# EAGLE design vca (EAGLE 7.5.0)
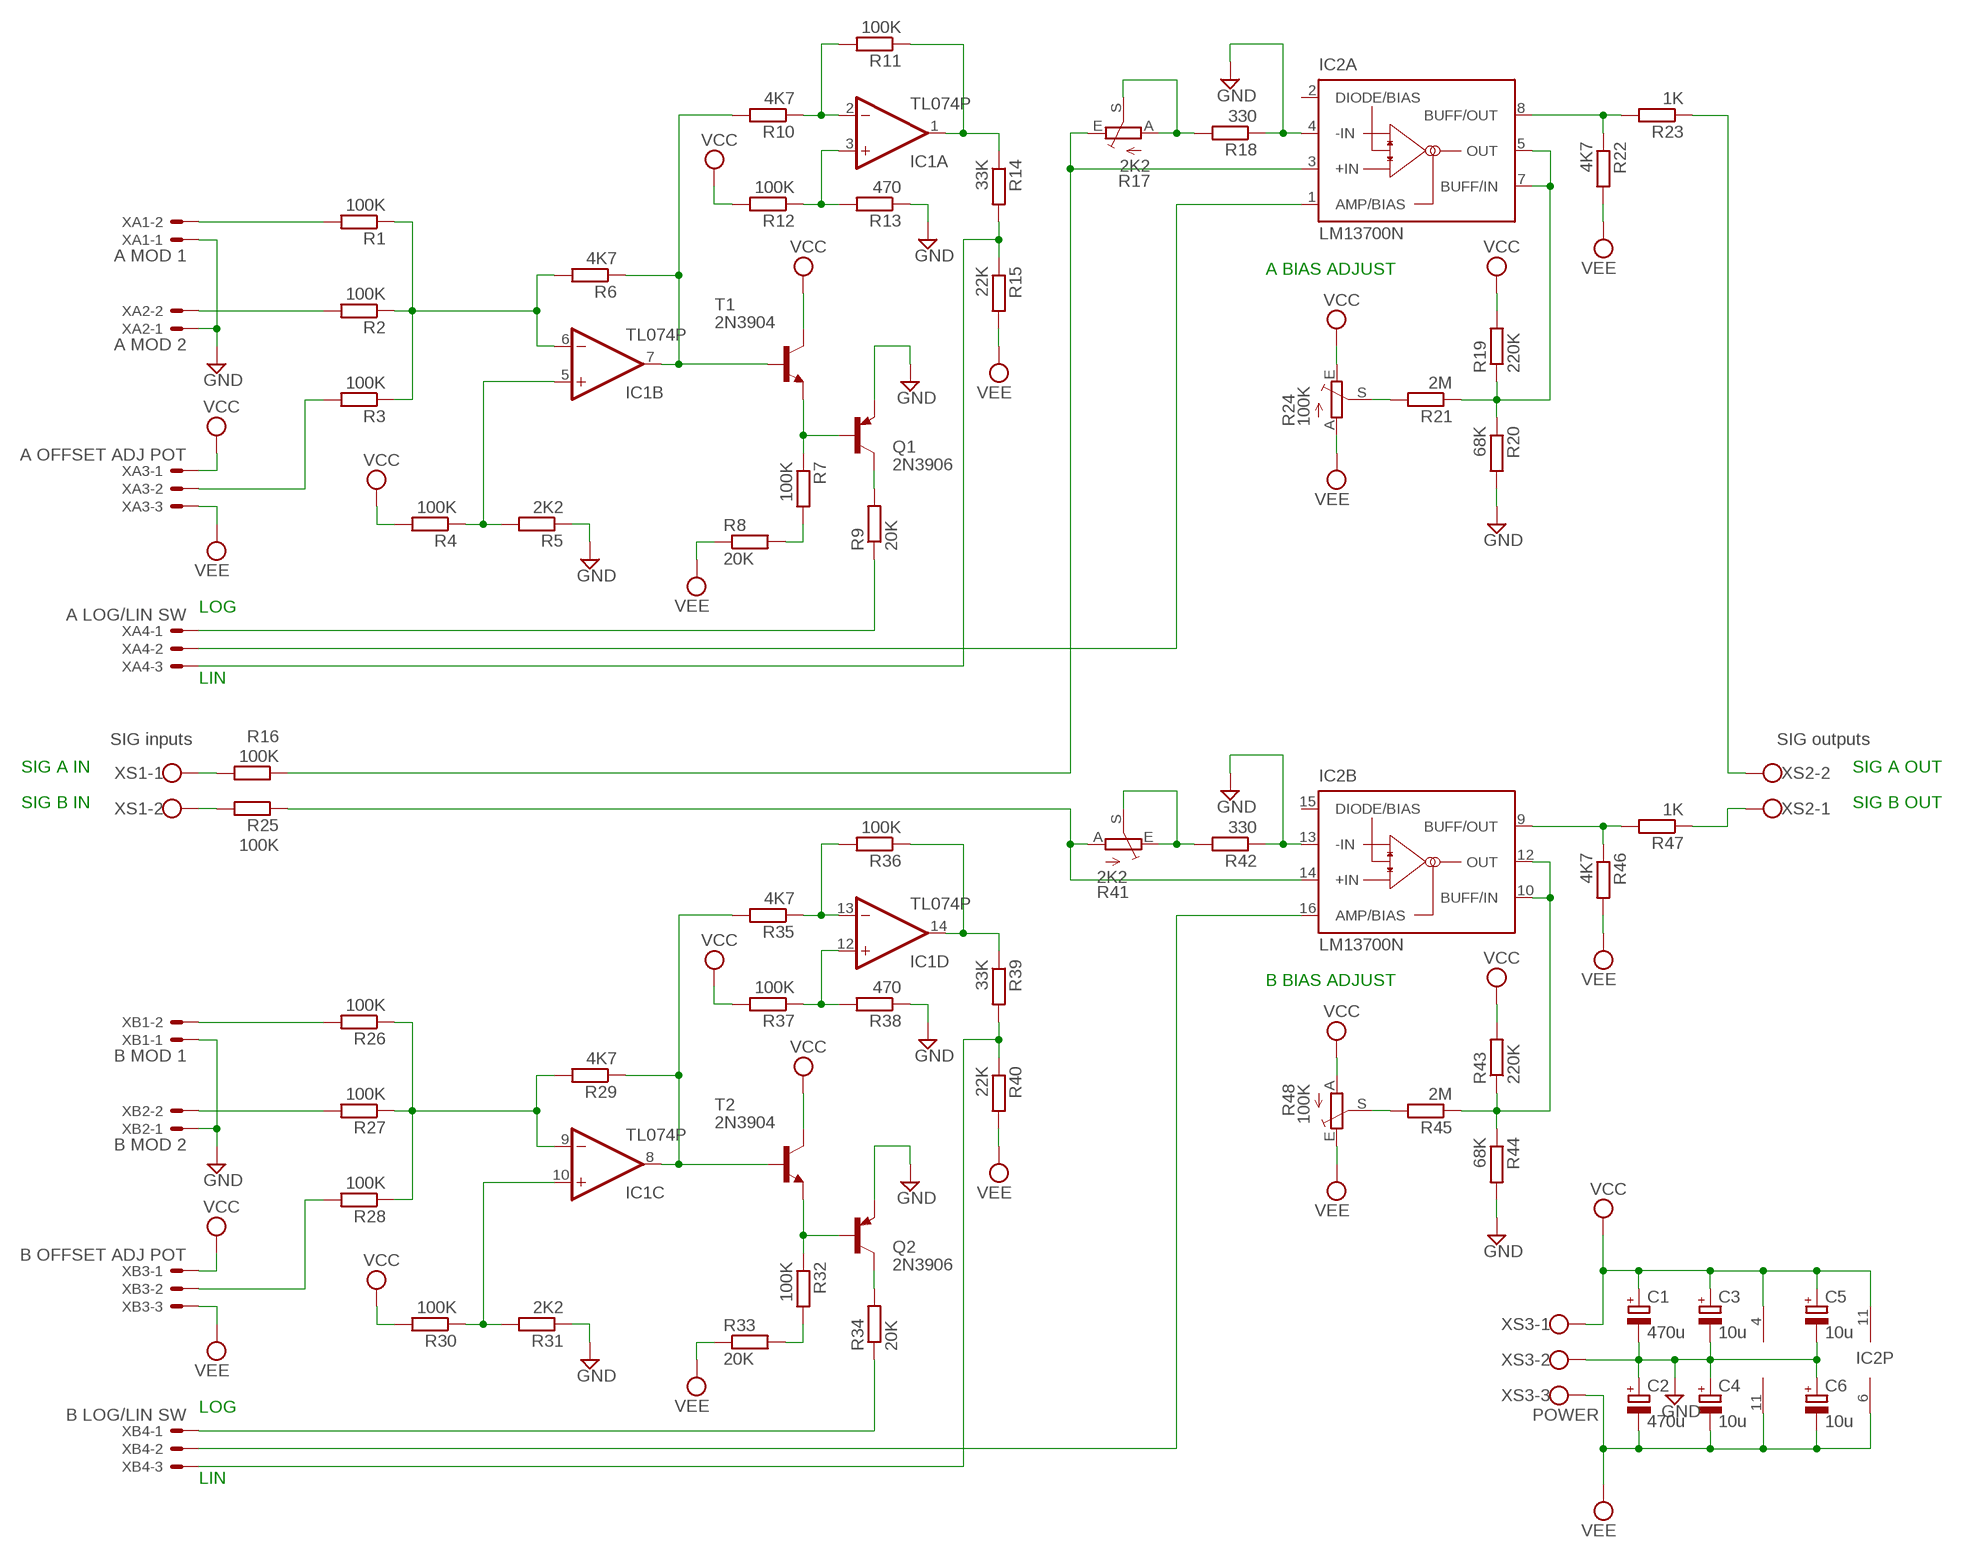
[diagram p0: schematic, sheet 1]

## Parts
C1  470u  CPOL-EUE2.5-6  [E2,5-6]
C2  470u  CPOL-EUE2.5-6  [E2,5-6]
C3  10u  CPOL-EUE1.8-4  [E1,8-4]
C4  10u  CPOL-EUE1.8-4  [E1,8-4]
C5  10u  CPOL-EUE1.8-4  [E1,8-4]
C6  10u  CPOL-EUE1.8-4  [E1,8-4]
IC1  TL074P  [DIL14]
IC2  LM13700N  LM13600AN  [DIL16]
Q1  2N3906  [TO92]
Q2  2N3906  [TO92]
R1  100K  R-EU_0204/7  [0204/7]
R2  100K  R-EU_0204/7  [0204/7]
R3  100K  R-EU_0204/7  [0204/7]
R4  100K  R-EU_0204/7  [0204/7]
R5  2K2  R-EU_0204/7  [0204/7]
R6  4K7  R-EU_0204/7  [0204/7]
R7  100K  R-EU_0204/7  [0204/7]
R8  20K  R-EU_0204/7  [0204/7]
R9  20K  R-EU_0204/7  [0204/7]
R10  4K7  R-EU_0204/7  [0204/7]
R11  100K  R-EU_0204/7  [0204/7]
R12  100K  R-EU_0204/7  [0204/7]
R13  470  R-EU_0204/7  [0204/7]
R14  33K  R-EU_0204/7  [0204/7]
R15  22K  R-EU_0204/7  [0204/7]
R16  100K  R-EU_0204/7  [0204/7]
R17  2K2  TRIM_EU-CA6V  [CA6V]
R18  330  R-EU_0204/7  [0204/7]
R19  220K  R-EU_0204/7  [0204/7]
R20  68K  R-EU_0204/7  [0204/7]
R21  2M  R-EU_0204/7  [0204/7]
R22  4K7  R-EU_0204/7  [0204/7]
R23  1K  R-EU_0204/7  [0204/7]
R24  100K  TRIM_EU-CA6V  [CA6V]
R25  100K  R-EU_0204/7  [0204/7]
R26  100K  R-EU_0204/7  [0204/7]
R27  100K  R-EU_0204/7  [0204/7]
R28  100K  R-EU_0204/7  [0204/7]
R29  4K7  R-EU_0204/7  [0204/7]
R30  100K  R-EU_0204/7  [0204/7]
R31  2K2  R-EU_0204/7  [0204/7]
R32  100K  R-EU_0204/7  [0204/7]
R33  20K  R-EU_0204/7  [0204/7]
R34  20K  R-EU_0204/7  [0204/7]
R35  4K7  R-EU_0204/7  [0204/7]
R36  100K  R-EU_0204/7  [0204/7]
R37  100K  R-EU_0204/7  [0204/7]
R38  470  R-EU_0204/7  [0204/7]
R39  33K  R-EU_0204/7  [0204/7]
R40  22K  R-EU_0204/7  [0204/7]
R41  2K2  TRIM_EU-CA6V  [CA6V]
R42  330  R-EU_0204/7  [0204/7]
R43  220K  R-EU_0204/7  [0204/7]
R44  68K  R-EU_0204/7  [0204/7]
R45  2M  R-EU_0204/7  [0204/7]
R46  4K7  R-EU_0204/7  [0204/7]
R47  1K  R-EU_0204/7  [0204/7]
R48  100K  TRIM_EU-CA6V  [CA6V]
T1  2N3904  [TO92]
T2  2N3904  [TO92]
XA1  A MOD 1  22-23-2021  [22-23-2021]
XA2  A MOD 2  22-23-2021  [22-23-2021]
XA3  A OFFSET ADJ POT  22-23-2031  [22-23-2031]
XA4  A LOG/LIN SW  22-23-2031  [22-23-2031]
XB1  B MOD 1  22-23-2021  [22-23-2021]
XB2  B MOD 2  22-23-2021  [22-23-2021]
XB3  B OFFSET ADJ POT  22-23-2031  [22-23-2031]
XB4  B LOG/LIN SW  22-23-2031  [22-23-2031]
XS1  SIG inputs  W237-102  [W237-102]
XS2  SIG outputs  W237-102  [W237-102]
XS3  POWER  W237-103  [W237-103]

## Nets
GND: C1.- C2.+ C3.- C4.+ C5.- C6.+ IC2.4(A:-IN) IC2.13(B:-IN) Q1.3(E) Q2.3(E) R5.1 R13.1 R18.1 R20.2 R31.1 R38.1 R42.1 R44.2 XA1.1 XA2.1 XB1.1 XB2.1 XS3.2
N$1: IC1.6(B:-IN) R1.1 R2.1 R3.1 R6.2
N$2: R1.2 XA1.2
N$3: R2.2 XA2.2
N$4: R3.2 XA3.2
N$5: IC1.5(B:+IN) R4.1 R5.2
N$6: R7.2 R8.2
N$7: IC1.7(B:OUT) R6.1 R10.2 T1.2(B)
N$8: Q1.2(B) R7.1 T1.3(E)
N$9: Q1.1(C) R9.2
N$10: R9.1 XA4.1
N$11: IC1.2(A:-IN) R10.1 R11.2
N$12: IC2.1(A:AMP/BIAS) XA4.2
N$13: IC1.1(A:OUT) R11.1 R14.1
N$14: IC2.3(A:+IN) R16.1 R17.E
N$15: IC1.3(A:+IN) R12.1 R13.2
N$16: R17.A R17.S R18.2
N$17: R14.2 R15.1 XA4.3
N$18: IC2.8(A:BUFF/OUT) R22.1 R23.2
N$20: R16.2 XS1.1
N$21: R25.2 XS1.2
N$23: R21.2 R24.S
N$24: IC2.5(A:OUT) IC2.7(A:BUFF/IN) R19.1 R20.1 R21.1
N$25: IC2.14(B:+IN) R25.1 R41.A
N$26: R26.2 XB1.2
N$27: R23.1 XS2.2
N$28: R27.2 XB2.2
N$29: R28.2 XB3.2
N$30: R34.1 XB4.1
N$31: R47.1 XS2.1
N$32: IC2.16(B:AMP/BIAS) XB4.2
N$35: IC1.9(C:-IN) R26.1 R27.1 R28.1 R29.2
N$36: IC1.8(C:OUT) R29.1 R35.2 T2.2(B)
N$37: IC1.10(C:+IN) R30.1 R31.2
N$39: Q2.2(B) R32.1 T2.3(E)
N$40: R32.2 R33.2
N$41: Q2.1(C) R34.2
N$42: IC1.13(D:-IN) R35.1 R36.2
N$43: IC1.14(D:OUT) R36.1 R39.1
N$44: IC1.12(D:+IN) R37.1 R38.2
N$45: R39.2 R40.1 XB4.3
N$46: R41.E R41.S R42.2
N$47: R45.2 R48.S
N$49: IC2.9(B:BUFF/OUT) R46.1 R47.2
N$50: IC2.10(B:BUFF/IN) IC2.12(B:OUT) R43.1 R44.1 R45.1
VCC: C1.+ C3.+ C5.+ IC1.4(P:V+) IC2.11(P:V+) R4.2 R12.2 R19.2 R24.E R30.2 R37.2 R43.2 R48.A T1.1(C) T2.1(C) XA3.1 XB3.1 XS3.1
VEE: C2.- C4.- C6.- IC1.11(P:V-) IC2.6(P:V-) R8.1 R15.2 R22.2 R24.A R33.1 R40.2 R46.2 R48.E XA3.3 XB3.3 XS3.3
Unconnected: IC2.2(A:DIODE/BIAS) IC2.15(B:DIODE/BIAS)

## Notes on the sheet
- A BIAS ADJUST
- LOG
- LIN
- SIG A IN | SIG A OUT
- SIG B IN | SIG B OUT
- B BIAS ADJUST
- LOG
- LIN

## Library data of the parts
C1-C6 = rcl:CPOL-EU: POLARIZED CAPACITOR, European symbol
IC1 = linear:TL074: OP AMP
IC2 = national-semiconductor:LM13600: Dual Operational Transconductance Amplifiers with Linearizing Diodes and Buffers Source: lm13600.PDF
Q1 Q2 = transistor-pnp:2N3906: PNP Transistor
R1-R16 R18-R23 R25-R40 R42-R47 = rcl:R-EU_: RESISTOR, European symbol
R17 R24 R41 R48 = pot:TRIM_EU-: POTENTIOMETER
T1 T2 = transistor:2N3904: NPN TRANSISTOR
XA1 XA2 XB1 XB2 = con-molex:22-23-2021: .100" (2.54mm) Center Header - 2 Pin; MF: MOLEX; MPN: 22-23-2021; OC_FARNELL: 1462926; OC_NEWARK: 25C3832
XA3 XA4 XB3 XB4 = con-molex:22-23-2031: .100" (2.54mm) Center Header - 3 Pin; MF: MOLEX; MPN: 22-23-2031; OC_FARNELL: 1462950; OC_NEWARK: 30C0862
XS1 XS2 = con-wago-500:W237-102: WAGO SCREW CLAMP; MPN: 237-102; OC_FARNELL: unknown; OC_NEWARK: 70K9898
XS3 = con-wago-500:W237-103: WAGO SCREW CLAMP; MPN: 237-103; OC_FARNELL: unknown; OC_NEWARK: 18M7116

## Board
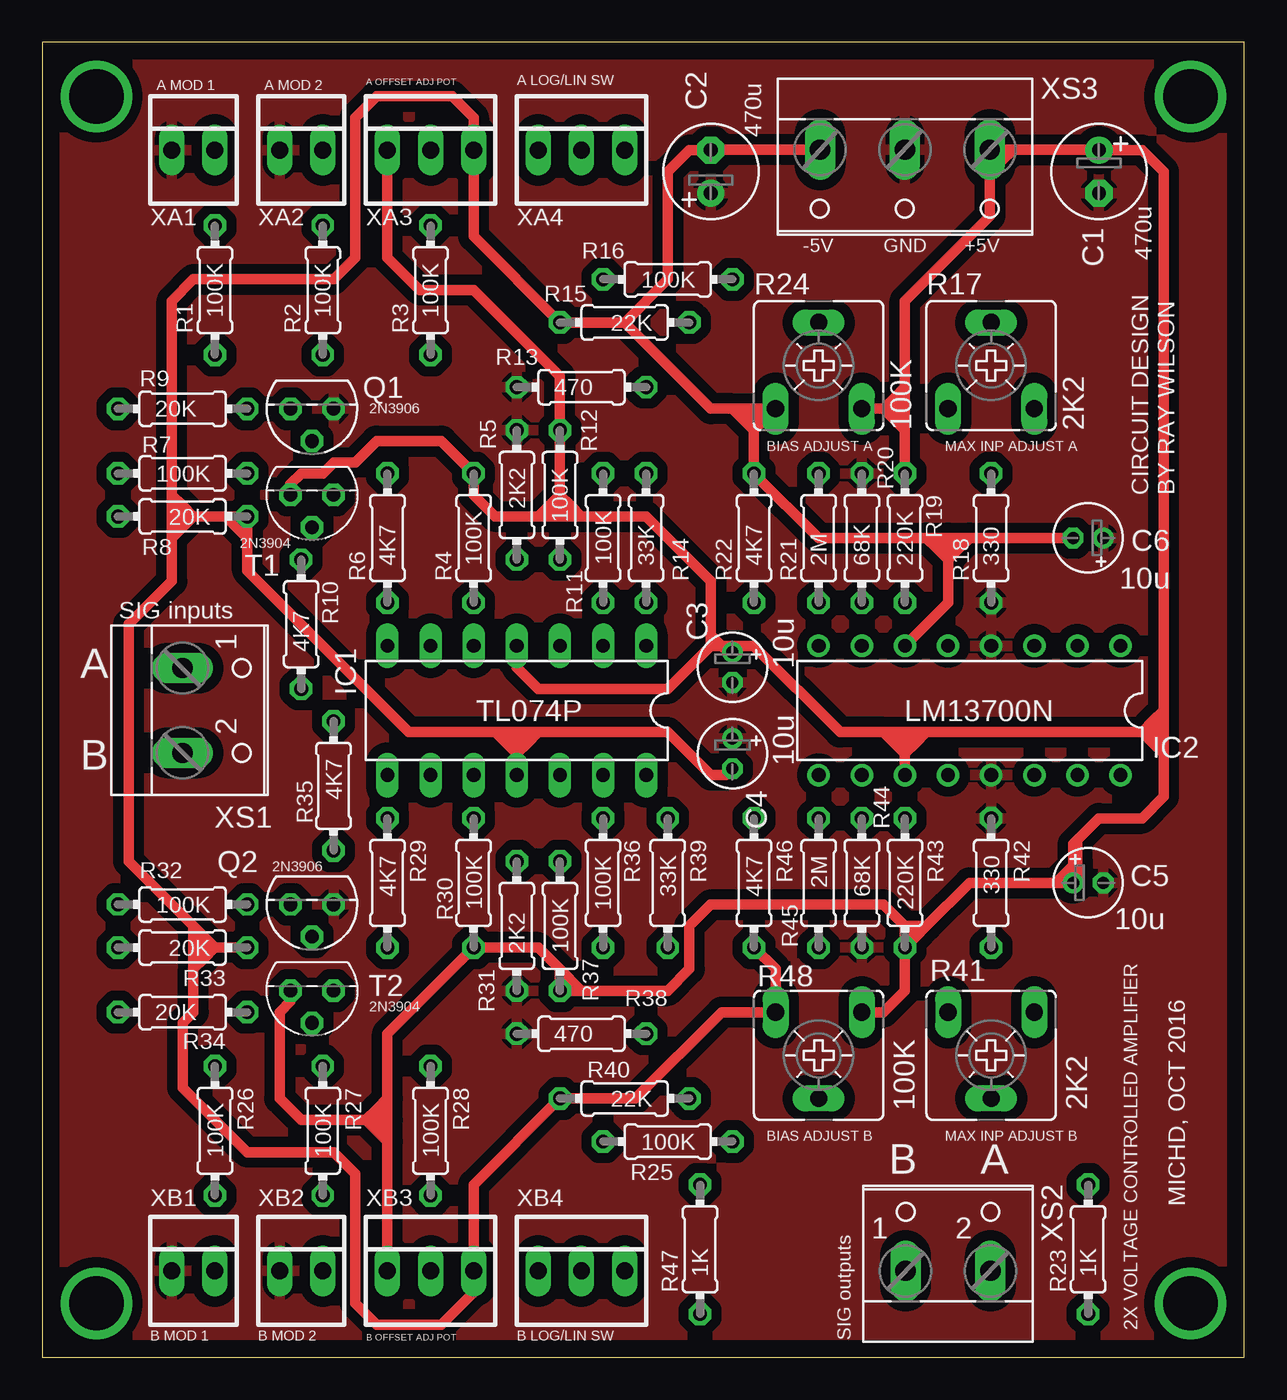
[diagram p1: board, top side]
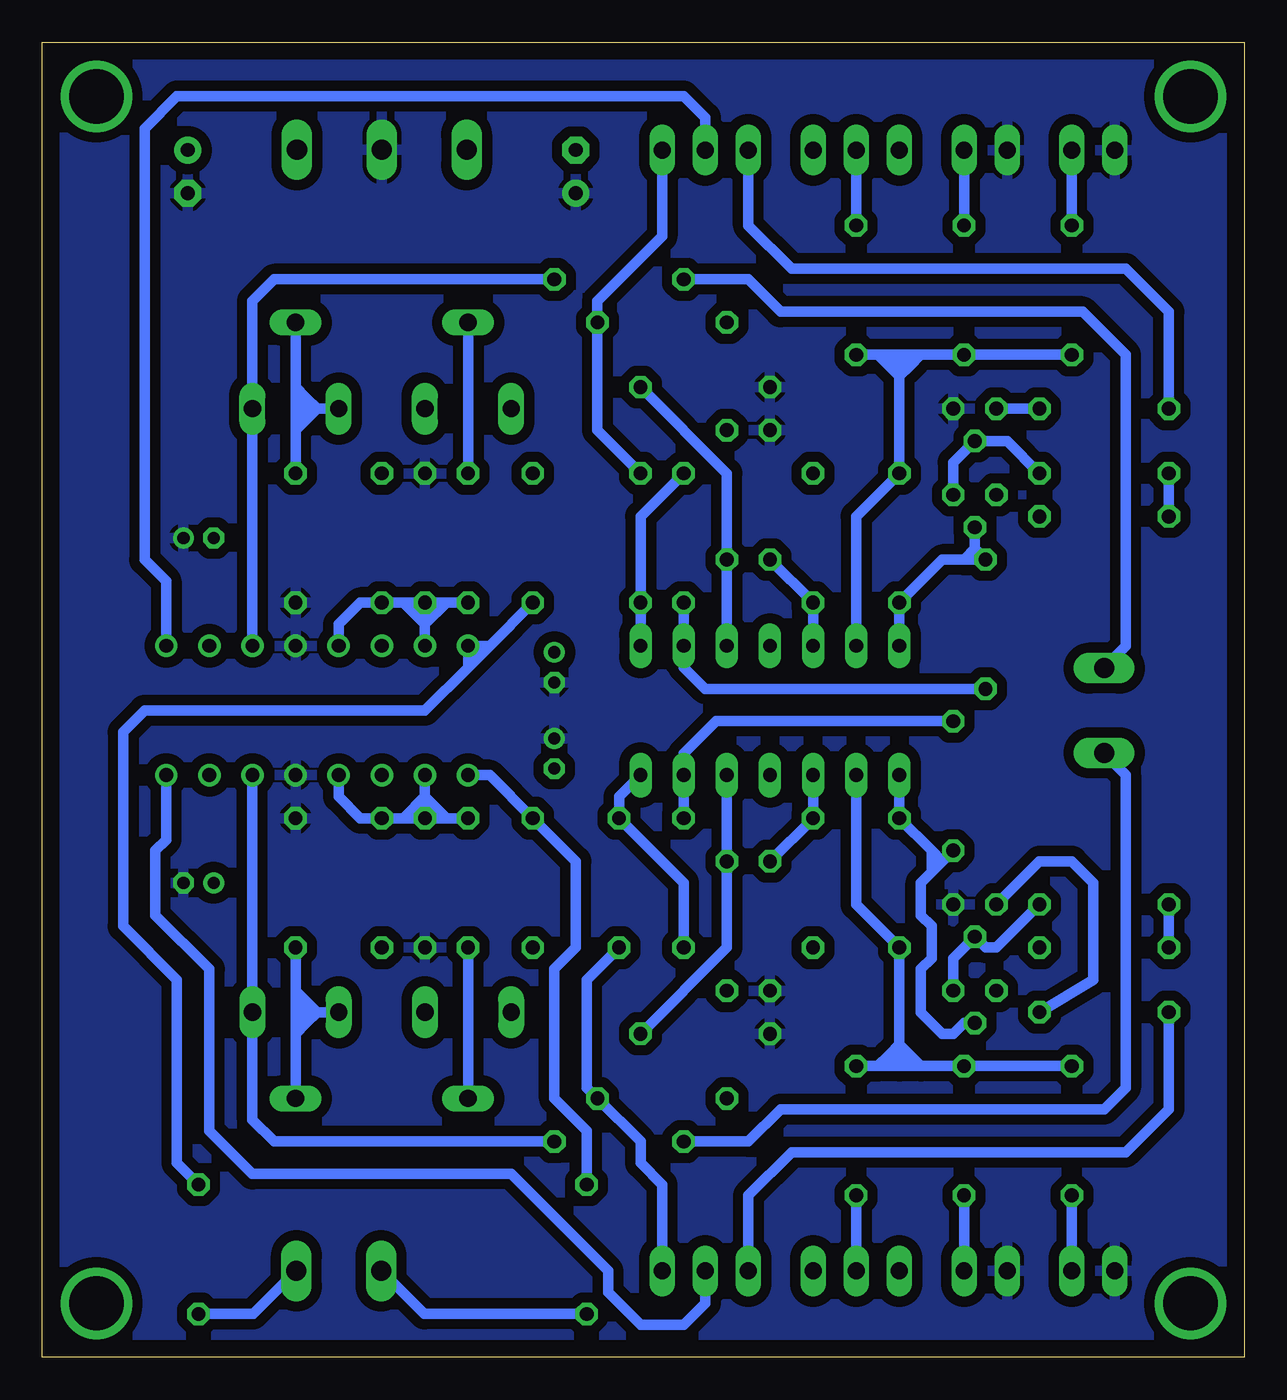
[diagram p2: board, bottom side, seen from below]

Size 70.79 x 77.46 mm. Coordinates in mm from the lower left corner, seen from the top.
Outline: 0,0 70.79,0 70.79,77.46 0,77.46 0,0
Copper layers (1*16): Top 0.035mm / dielectric 1.5mm / Bottom 0.035mm
Design rules "default": minimum track width 10mil, minimum drill 24mil, track to track 8mil, track to pad 8mil, pad to pad 8mil, via to via 8mil, smd to smd 8mil, copper to edge 40mil, drill to drill 8mil, minimum pad ring 10mil, minimum via ring 8mil, stop-mask expansion 4mil, vias tented up to drill 0mil, thermal gap 10mil

### Footprints (pad centres in the part's own frame; a part is rotated, then mirrored left to right if it is on the bottom)
E2,5-6 = drill 0.813 pad 1.6: + -1.27,0 | drill 0.813 pad 1.6 octagon: - 1.27,0
E1,8-4 = drill 0.711 pad 1.168: + -0.889,0 | drill 0.711 pad 1.168 octagon: - 0.889,0
DIL14 = drill 0.813 long: 1 -7.62,-3.81; 2 -5.08,-3.81; 3 -2.54,-3.81; 4 0,-3.81; 5 2.54,-3.81; 6 5.08,-3.81; 7 7.62,-3.81; 8 7.62,3.81; 9 5.08,3.81; 10 2.54,3.81; 11 0,3.81; 12 -2.54,3.81; 13 -5.08,3.81; 14 -7.62,3.81
DIL16 = drill 0.813 pad 1.27: 1 -8.89,-3.81; 2 -6.35,-3.81; 3 -3.81,-3.81; 4 -1.27,-3.81; 5 1.27,-3.81; 6 3.81,-3.81; 7 6.35,-3.81; 8 8.89,-3.81; 9 8.89,3.81; 10 6.35,3.81; 11 3.81,3.81; 12 1.27,3.81; 13 -1.27,3.81; 14 -3.81,3.81; 15 -6.35,3.81; 16 -8.89,3.81
TO92 = drill 0.813 octagon: 1 1.27,0; 2 0,1.905; 3 -1.27,0
0204/7 = drill 0.813 octagon: 1 -3.81,0; 2 3.81,0
CA6V = drill 1.016 long: A -2.54,-2.54; E 2.54,-2.54; S 0,2.54
22-23-2021 = drill 1 long: 1 -1.27,0; 2 1.27,0
22-23-2031 = drill 1 long: 1 -2.54,0; 2 0,0; 3 2.54,0
W237-102 = drill 1.194 long: 1 -2.5,-1.27; 2 2.5,-1.27
W237-103 = drill 1.194 long: 1 -5,-1.29; 2 0,-1.29; 3 5,-1.29

### Placement (x,y rotation side)
C1  62.23,69.85 270 top
C2  39.37,69.85 90 top
C3  40.64,40.64 270 top
C4  40.64,35.56 270 top
C5  61.59,27.94 0 top
C6  61.59,48.26 180 top
IC1  27.94,38.1 180 top
IC2  54.61,38.1 180 top
Q1  15.88,55.88 180 top
Q2  15.88,26.67 180 top
R1  10.16,62.87 90 top
R2  16.51,62.87 90 top
R3  22.86,62.87 90 top
R4  25.4,48.26 90 top
R5  27.94,50.8 270 top
R6  20.32,48.26 90 top
R7  8.26,52.07 180 top
R8  8.26,49.53 180 top
R9  8.26,55.88 0 top
R10  15.24,43.18 90 top
R11  33.02,48.26 270 top
R12  30.48,50.8 90 top
R13  31.75,57.15 0 top
R14  35.56,48.26 90 top
R15  34.29,60.96 180 top
R16  36.83,63.5 180 top
R17  55.88,58.42 0 top
R18  55.88,48.26 90 top
R19  50.8,48.26 90 top
R20  48.26,48.26 90 top
R21  45.72,48.26 90 top
R22  41.91,48.26 90 top
R23  61.59,6.35 90 top
R24  45.72,58.42 0 top
R25  36.83,12.7 180 top
R26  10.16,13.34 270 top
R27  16.51,13.34 270 top
R28  22.86,13.34 270 top
R29  20.32,27.94 270 top
R30  25.4,27.94 270 top
R31  27.94,25.4 90 top
R32  8.26,26.67 180 top
R33  8.26,24.13 180 top
R34  8.26,20.32 0 top
R35  17.14,33.66 270 top
R36  33.02,27.94 90 top
R37  30.48,25.4 270 top
R38  31.75,19.05 0 top
R39  36.83,27.94 270 top
R40  34.29,15.24 180 top
R41  55.88,17.78 180 top
R42  55.88,27.94 270 top
R43  50.8,27.94 270 top
R44  48.26,27.94 270 top
R45  45.72,27.94 270 top
R46  41.91,27.94 270 top
R47  38.73,6.35 90 top
R48  45.72,17.78 180 top
T1  15.88,50.8 180 top
T2  15.88,21.59 180 top
XA1  8.89,71.12 0 top
XA2  15.24,71.12 0 top
XA3  22.86,71.12 0 top
XA4  31.75,71.12 0 top
XB1  8.89,5.08 0 top
XB2  15.24,5.08 0 top
XB3  22.86,5.08 0 top
XB4  31.75,5.08 0 top
XS1  9.53,38.1 270 top
XS2  53.34,6.35 0 top
XS3  50.8,69.85 180 top

### Tracks (layer width: path | path; a pad name or v marks a point on that pad's centre or on a via)
GND
  pour Top (isolate 0.61): 0,77.47 70.48,77.47 70.48,0 0,0
  pour Bottom (isolate 0.61): 0,77.47 70.48,77.47 70.48,0 0,0
N$1
  Bottom 0.61: R1.1 R2.1 19.05,59.05 | 19.05,59.05 20.32,59.05 | 20.32,59.05 21.59,59.05 | 21.59,59.05 R3.1 | IC1.6 22.86,49.53 R6.2 20.32,57.78 | 20.32,57.78 20.32,59.05 | 20.32,57.78 19.68,58.42 | 19.68,58.42 19.05,59.05 | 20.32,57.78 20.95,58.42 | 20.95,58.42 21.59,59.05 | 20.95,58.42 20.32,59.05 | 20.32,59.05 19.68,58.42
N$2
  Bottom 0.61: R1.2 XA1.2
N$3
  Bottom 0.61: XA2.2 R2.2
N$4
  Bottom 0.61: XA3.2 R3.2
N$5
  Bottom 0.61: IC1.5 R4.1 R5.2
N$6
  Bottom 0.61: R7.2 R8.2
N$7
  Bottom 0.61: IC1.7 R6.1 17.78,46.99 16.51,46.99 | 16.51,46.99 R10.2 15.88,47.62 | T1.2 15.88,47.62 | 15.88,47.62 16.51,46.99
N$8
  Bottom 0.61: R7.1 13.97,53.98 Q1.2 17.14,52.7 T1.3
N$9
  Bottom 0.61: R9.2 Q1.1
N$10
  Bottom 0.61: R9.1 4.45,61.59 6.99,64.14 26.67,64.14 29.21,66.67 XA4.1
N$11
  Bottom 0.61: R10.1 31.75,39.37 33.02,40.64 IC1.2 R11.2
N$12
  Bottom 0.61: XA4.2 31.75,73.03 33.02,74.3 62.87,74.3 64.77,72.39 64.77,46.99 63.5,45.72 IC2.1
N$13
  Bottom 0.61: R11.1 35.56,49.53 R14.1 IC1.1
N$14
  Bottom 0.61: R16.1 57.15,63.5 58.42,62.23 R17.E IC2.3
N$15
  Bottom 0.61: IC1.3 R12.1 30.48,52.07 R13.2
N$16
  Bottom 0.61: R18.2 55.88,54.61 | 55.88,54.61 55.88,55.88 | 55.88,55.88 55.88,57.15 | 55.88,57.15 R17.S | R17.A 54.61,55.88 | 54.61,55.88 55.88,55.88 | 54.61,55.88 55.24,56.52 | 55.24,56.52 55.88,57.15 | 54.61,55.88 55.24,55.24 | 55.24,55.24 55.88,54.61 | 55.88,55.88 55.24,55.24 | 55.88,55.88 55.24,56.52
N$17
  Bottom 0.61: R14.2 38.1,54.61 R15.1 38.1,62.23 34.29,66.04 XA4.3
N$18
  Bottom 0.61: 45.72,40.64 IC2.8 44.45,41.91 | 45.72,40.64 48.26,38.1 64.77,38.1 66.04,36.83 66.04,25.4 62.87,22.23 62.87,11.43 R23.2 | R22.1 44.45,41.91 | 44.45,41.91 45.72,40.64
N$19
  Top 0.61: 55.88,71.12 57.15,71.12 56.52,70.48 | 56.52,70.48 55.88,69.85 55.88,71.12 | 55.88,71.12 56.52,70.48
N$20
  Bottom 0.61: XS1.1 6.99,41.91 6.99,59.05 9.53,61.59 27.3,61.59 29.21,63.5 R16.2
N$21
  Bottom 0.61: XS1.2 6.99,34.29 6.99,15.88 8.26,14.61 27.3,14.61 29.21,12.7 R25.2
N$22  (via drill 3.2 pad 3.81)
  other vias: 3.17,74.28
N$23
  Bottom 0.61: R24.S R21.2
N$24
  Bottom 0.61: IC2.7 48.26,43.18 | 48.26,43.18 49.53,44.45 R19.1 | R19.1 52.07,44.45 53.34,43.18 IC2.5 | R20.1 48.26,43.18 | R20.1 R19.1 | R21.1 46.99,44.45 | 46.99,44.45 R20.1 | 48.26,43.18 46.99,44.45
N$25
  Bottom 0.61: R25.1 57.15,12.7 58.42,13.97 R41.A IC2.14
N$26
  Bottom 0.61: R26.2 XB1.2
N$27
  Bottom 0.61: R23.1 58.38,2.54 XS2.2
N$28
  Bottom 0.61: R27.2 XB2.2
N$29
  Bottom 0.61: R28.2 XB3.2
N$30
  Bottom 0.61: R34.1 4.45,14.61 6.99,12.06 26.67,12.06 29.21,9.53 XB4.1
N$31
  Bottom 0.61: R47.1 48.3,2.54 XS2.1
N$32
  Bottom 0.61: XB4.2 31.75,3.17 33.02,1.91 35.56,1.91 37.47,3.81 37.47,5.08 43.18,10.79 58.42,10.79 60.96,13.34 60.96,22.86 64.14,26.04 64.14,29.84 63.5,30.48 IC2.16
N$33  (via drill 3.2 pad 3.81)
  other vias: 67.61,74.28
N$34  (via drill 3.2 pad 3.81)
  other vias: 3.17,3.17
N$35
  Bottom 0.61: R26.1 R27.1 19.05,17.14 | 19.05,17.14 20.32,17.14 | 20.32,17.14 21.59,17.14 | 21.59,17.14 R28.1 | IC1.9 22.86,26.67 R29.2 20.32,18.41 | 20.32,17.14 20.32,18.41 | 19.05,17.14 19.68,17.78 | 19.68,17.78 20.32,18.41 | 20.32,18.41 20.95,17.78 | 20.95,17.78 21.59,17.14 | 20.32,17.14 20.95,17.78 | 20.32,17.14 19.68,17.78
N$36
  Bottom 0.61: IC1.8 R29.1 18.41,29.84 | R35.2 17.78,29.21 | 17.78,29.21 18.41,29.84 | T2.2 16.51,19.68 17.14,19.05 17.78,19.05 19.05,20.32 19.05,22.86 18.41,23.5 18.41,25.4 19.05,26.04 19.05,27.94 18.41,28.57 | 18.41,28.57 17.78,29.21 | 18.41,28.57 18.41,29.84
N$37
  Bottom 0.61: IC1.10 R30.1 R31.2
N$38  (via drill 3.2 pad 3.81)
  other vias: 67.61,3.17
N$39
  Bottom 0.61: R32.1 14.61,24.13 15.24,24.13 Q2.2 17.14,23.5 T2.3
N$40
  Bottom 0.61: R32.2 R33.2
N$41
  Bottom 0.61: R34.2 8.89,22.23 8.89,27.94 10.16,29.21 12.06,29.21 Q2.1
N$42
  Bottom 0.61: R35.1 31.11,37.47 33.02,35.56 IC1.13 R36.2
N$43
  Bottom 0.61: R36.1 33.02,27.94 R39.1 36.83,33.02 IC1.14
N$44
  Bottom 0.61: IC1.12 R37.1 30.48,24.13 R38.2
N$45
  Bottom 0.61: R39.2 38.73,22.23 38.73,15.88 R40.1 35.56,12.7 35.56,11.43 34.29,10.16 XB4.3
N$46
  Bottom 0.61: R42.2 55.88,21.59 | 55.88,21.59 55.88,20.32 | 55.88,20.32 55.88,19.05 | 55.88,19.05 R41.S | R41.E 54.61,20.32 | 54.61,20.32 55.88,20.32 | 54.61,20.32 55.24,20.95 | 55.24,20.95 55.88,21.59 | 54.61,20.32 55.24,19.68 | 55.24,19.68 55.88,19.05 | 55.88,20.32 55.24,19.68 | 55.88,20.32 55.24,20.95
N$47
  Bottom 0.61: R48.S R45.2
N$48
  pour Top (isolate 0.61): 1.27,76.2 69.85,76.2 69.85,1.27 1.27,1.27
N$49
  Bottom 0.61: R47.2 38.73,13.34 40.64,15.24 40.64,22.86 39.37,24.13 39.37,29.21 R46.1 44.45,34.29 IC2.9
N$50
  Bottom 0.61: IC2.10 48.26,33.02 | 48.26,33.02 49.53,31.75 | 49.53,31.75 R43.1 52.07,31.75 53.34,33.02 IC2.12 | R44.1 49.53,31.75 | R44.1 48.26,33.02 | R45.1 46.99,31.75 | 46.99,31.75 R44.1 | 48.26,33.02 46.99,31.75
N$51
  pour Bottom (isolate 0.61): 1.27,76.2 69.85,76.2 69.85,1.27 1.27,1.27
VCC
  Top 0.61: R19.2 50.8,54.61 | 50.8,54.61 50.8,55.88 | 50.8,55.88 50.8,57.15 | 50.8,57.15 50.8,62.23 55.8,67.23 XS3.1 62.23,71.14 C1.+ 64.77,71.12 66.04,69.85 66.04,38.1 | R24.E 49.53,55.88 | 49.53,55.88 50.8,55.88 | 49.53,55.88 50.16,56.52 | 50.16,56.52 50.8,57.15 | 49.53,55.88 50.16,55.24 | 50.16,55.24 50.8,54.61 | 50.8,55.88 50.16,55.24 | 50.8,55.88 50.16,56.52 | C5.+ 60.71,30.23 60.96,30.48 | 60.96,30.48 62.23,31.75 64.77,31.75 66.04,33.02 66.04,35.56 | 66.04,35.56 66.04,36.83 | 66.04,36.83 66.04,38.1 | IC2.11 50.8,35.56 | 50.8,35.56 51.44,36.2 | 51.44,36.2 52.07,36.83 | 52.07,36.83 64.77,36.83 | 64.77,36.83 66.04,36.83 | 64.77,36.83 65.41,37.47 | 65.41,37.47 66.04,38.1 | 64.77,36.83 65.41,36.2 | 65.41,36.2 66.04,35.56 | 66.04,36.83 65.41,36.2 | 66.04,36.83 65.41,37.47 | R43.2 51.44,24.77 | 51.44,24.77 52.07,25.4 | 52.07,25.4 54.61,27.94 59.69,27.94 | 59.69,27.94 C5.+ | 59.69,27.94 60.96,29.21 | 60.96,29.21 60.96,30.48 | 60.96,29.21 60.96,27.94 C5.+ | R43.2 50.8,21.59 49.53,20.32 R48.A | 31.75,21.59 R37.2 30.48,22.86 | 31.75,21.59 36.83,21.59 38.1,22.86 38.1,25.4 39.37,26.67 49.53,26.67 50.8,25.4 | 50.8,25.4 R43.2 | 50.8,25.4 52.07,25.4 | 50.8,25.4 51.44,24.77 | 30.48,22.86 29.21,24.13 R30.2 20.32,19.05 20.32,15.24 | XB3.1 20.32,12.7 | 20.32,12.7 20.32,13.97 | 20.32,13.97 20.32,15.24 | T2.1 14.61,20.95 13.97,20.32 13.97,15.24 15.24,13.97 19.05,13.97 | 19.05,13.97 20.32,13.97 | 19.05,13.97 19.68,14.61 | 19.68,14.61 20.32,15.24 | 19.05,13.97 19.68,13.34 | 19.68,13.34 20.32,12.7 | 20.32,13.97 19.68,13.34 | 20.32,13.97 19.68,14.61 | 50.8,35.56 50.16,36.2 | 50.16,36.2 49.53,36.83 | 49.53,36.83 46.99,36.83 41.91,41.91 41.02,41.91 | 41.02,41.91 C3.+ 40.39,41.53 40.01,41.91
  Top 0.61: 40.01,41.91 39.37,41.91 | 39.37,41.91 36.83,39.37 29.21,39.37 27.94,40.64 IC1.4 | 29.21,49.53 26.67,49.53 25.4,50.8 R4.2 23.5,53.98 19.68,53.98 18.41,52.7 17.14,52.7 16.51,52.07 15.24,52.07 14.61,51.44 T1.1 | 29.21,49.53 30.48,49.53 | 30.48,49.53 31.75,49.53 | 31.75,49.53 35.56,49.53 39.37,45.72 39.37,42.55 | 39.37,42.55 39.37,41.91 | 39.37,42.55 40.01,41.91 | 30.48,50.8 R12.2 30.48,57.78 25.4,62.87 22.23,62.87 20.32,64.77 XA3.1 | 30.48,50.8 30.48,49.53 | 29.21,49.53 29.84,50.16 | 29.84,50.16 30.48,50.8 | 30.48,50.8 31.11,50.16 | 31.11,50.16 31.75,49.53 | 30.48,49.53 29.84,50.16 | 30.48,49.53 31.11,50.16 | 49.53,36.83 50.8,36.83 | 50.8,36.83 52.07,36.83 | 50.16,36.2 50.8,36.83 | 50.8,36.83 51.44,36.2 | 51.44,36.2 50.16,36.2 | 41.02,41.91 40.01,41.91 | 30.48,22.86 31.75,21.59
VEE
  Top 0.61: XS3.3 39.39,71.14 C2.- 38.1,71.12 36.83,69.85 36.83,63.5 34.29,60.96 | 34.29,60.96 R15.2 25.4,66.04 XA3.3 25.4,73.03 24.13,74.3 19.68,74.3 18.41,73.03 18.41,64.77 17.14,63.5 8.89,63.5 7.62,62.23 7.62,50.8 | 7.62,48.26 7.62,45.72 5.08,43.18 5.08,29.21 8.89,25.4 | 7.62,48.26 7.62,49.53 | 7.62,49.53 7.62,50.8 | 41.91,55.88 R24.A 42.55,55.24 | 40.64,55.88 39.37,55.88 34.29,60.96 | 41.91,54.61 R22.2 45.72,48.26 52.07,48.26 | 52.07,48.26 53.34,48.26 | 53.34,48.26 54.61,48.26 | 54.61,48.26 C6.- | IC2.6 53.34,44.45 53.34,46.99 | 53.34,46.99 53.34,48.26 | 53.34,46.99 52.7,47.62 | 52.7,47.62 52.07,48.26 | 53.34,46.99 53.98,47.62 | 53.98,47.62 54.61,48.26 | 53.34,48.26 53.98,47.62 | 53.34,48.26 52.7,47.62 | 27.94,35.56 28.57,36.2 | 28.57,36.2 29.21,36.83 | 29.21,36.83 36.83,36.83 39.37,34.29 40.26,34.29 C4.- | IC1.11 27.94,35.56 | 27.94,35.56 27.3,36.2 | 27.3,36.2 26.67,36.83 | 26.67,36.83 21.59,36.83 12.06,46.35 12.06,48.26 | 12.06,48.26 R8.1 10.79,49.53 | 26.67,36.83 27.94,36.83 | 27.94,36.83 29.21,36.83 | 27.94,36.83 27.94,35.56 | 27.94,36.83 28.57,36.2 | 27.94,36.83 27.3,36.2 | R33.1 10.16,24.13 | 10.16,24.13 9.53,24.77 | 9.53,24.77 8.89,25.4 | 10.79,49.53 8.89,49.53 | 8.89,49.53 7.62,49.53 | 7.62,50.8 8.26,50.16 | 8.26,50.16 8.89,49.53 | 8.89,49.53 8.26,48.9 | 8.26,48.9 7.62,48.26 | 7.62,49.53 8.26,48.9 | 7.62,49.53 8.26,50.16 | 10.79,49.53 12.06,48.26 | 8.89,22.86 8.89,20.32 8.26,19.68 8.26,15.88 12.06,12.06 17.14,12.06 18.41,10.79 18.41,3.17 19.68,1.91 23.5,1.91 25.4,3.81 XB3.3 25.4,10.16 R40.2 34.92,15.24 40.01,20.32 R48.E 43.18,22.86 R46.2 | 8.89,22.86 9.53,23.5 | 9.53,23.5 10.16,24.13 | 8.89,25.4 8.89,24.13 | 8.89,24.13 8.89,22.86
  Top 0.61: 8.89,24.13 10.16,24.13 | 8.89,24.13 9.53,24.77 | 8.89,24.13 9.53,23.5 | 41.91,54.61 41.27,55.24 | 41.27,55.24 40.64,55.88 | 40.64,55.88 41.91,55.88 | 41.91,55.88 41.91,54.61 | 41.91,54.61 42.55,55.24 | 42.55,55.24 41.91,55.88 | 41.91,55.88 41.27,55.24

### Text on the board
tNames: -5V | GND | +5V | BIAS ADJUST A | MAX INP ADJUST A | CIRCUIT DESIGN / BY RAY WILSON | A | B | BIAS ADJUST B | MAX INP ADJUST B | B | A | MICHD, OCT 2016 | 2X VOLTAGE CONTROLLED AMPLIFIER